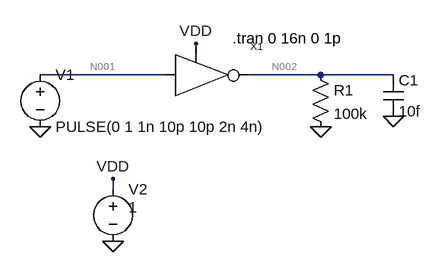
[diagram p0: schematic inverter_nand2_test.asc]
inverter_nand2_test.asc, the LTspice schematic file:
Version 4.1
SHEET 1 880 680
WIRE 176 144 176 128
WIRE 128 176 -64 176
WIRE 368 176 256 176
WIRE 480 176 368 176
WIRE 48 352 48 336
FLAG -64 256 0
FLAG 48 432 0
FLAG 368 256 0
FLAG 480 240 0
FLAG 48 336 VDD
FLAG 176 128 VDD
SYMBOL inverter_nand2 192 176 R0
SYMATTR InstName X1
SYMBOL voltage -64 160 R0
WINDOW 123 0 0 Left 0
WINDOW 39 0 0 Left 0
SYMATTR InstName V1
SYMATTR Value PULSE(0 1 1n 10p 10p 2n 4n)
SYMBOL voltage 48 336 R0
WINDOW 3 24 44 Left 2
WINDOW 123 0 0 Left 0
WINDOW 39 0 0 Left 0
SYMATTR Value 1
SYMATTR InstName V2
SYMBOL res 352 160 R0
SYMATTR InstName R1
SYMATTR Value 100k
SYMBOL cap 464 176 R0
SYMATTR InstName C1
SYMATTR Value 10f
TEXT 232 120 Left 2 !.tran 0 16n 0 1p

The netlist it stands for:
* inverter_nand2_test.asc
X§X1 N001 N002 VDD inverter_nand2  ; pins VIN VOUT VDD
V1 N001 0 PULSE(0 1 1n 10p 10p 2n 4n)
V2 VDD 0 1
R1 N002 0 100k
C1 N002 0 10f
.tran 0 16n 0 1p
.backanno
.end

* Results of the author's LTspice run, read from the files saved beside the schematic
* Operating Point, zero values left out:
*   V(n002) = 986.9 mV
*   V(vdd) = 1 V
*   I(V1) = 123.5 pA
*   I(V2) = -9.869 µA
*   I(R1) = 9.869 µA
*   Ix(x1:vin) = -123.5 pA
*   Ix(x1:vout) = -9.869 µA
*   Ix(x1:vdd) = 9.869 µA
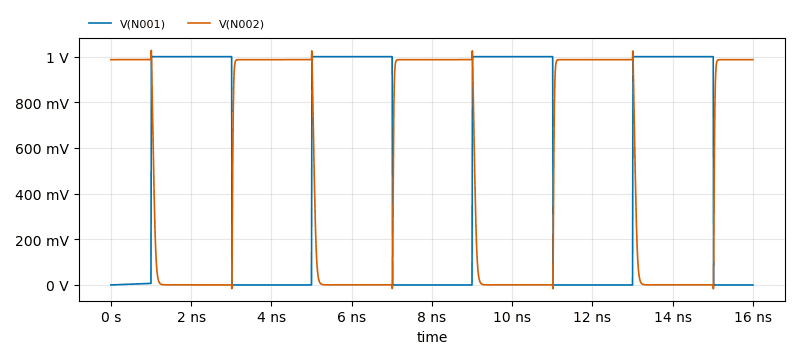
[diagram p1: Transient Analysis of inverter_nand2_test.asc, plotted from the saved traces]
* Transient Analysis, 1 run:
*   V(N001): min 0 V, max 1 V, average 502.5 mV, rms 708.3 mV, last 0 V
*   V(N002): min -16.83 mV, max 1.028 V, average 502.2 mV, rms 698 mV, last 986.8 mV